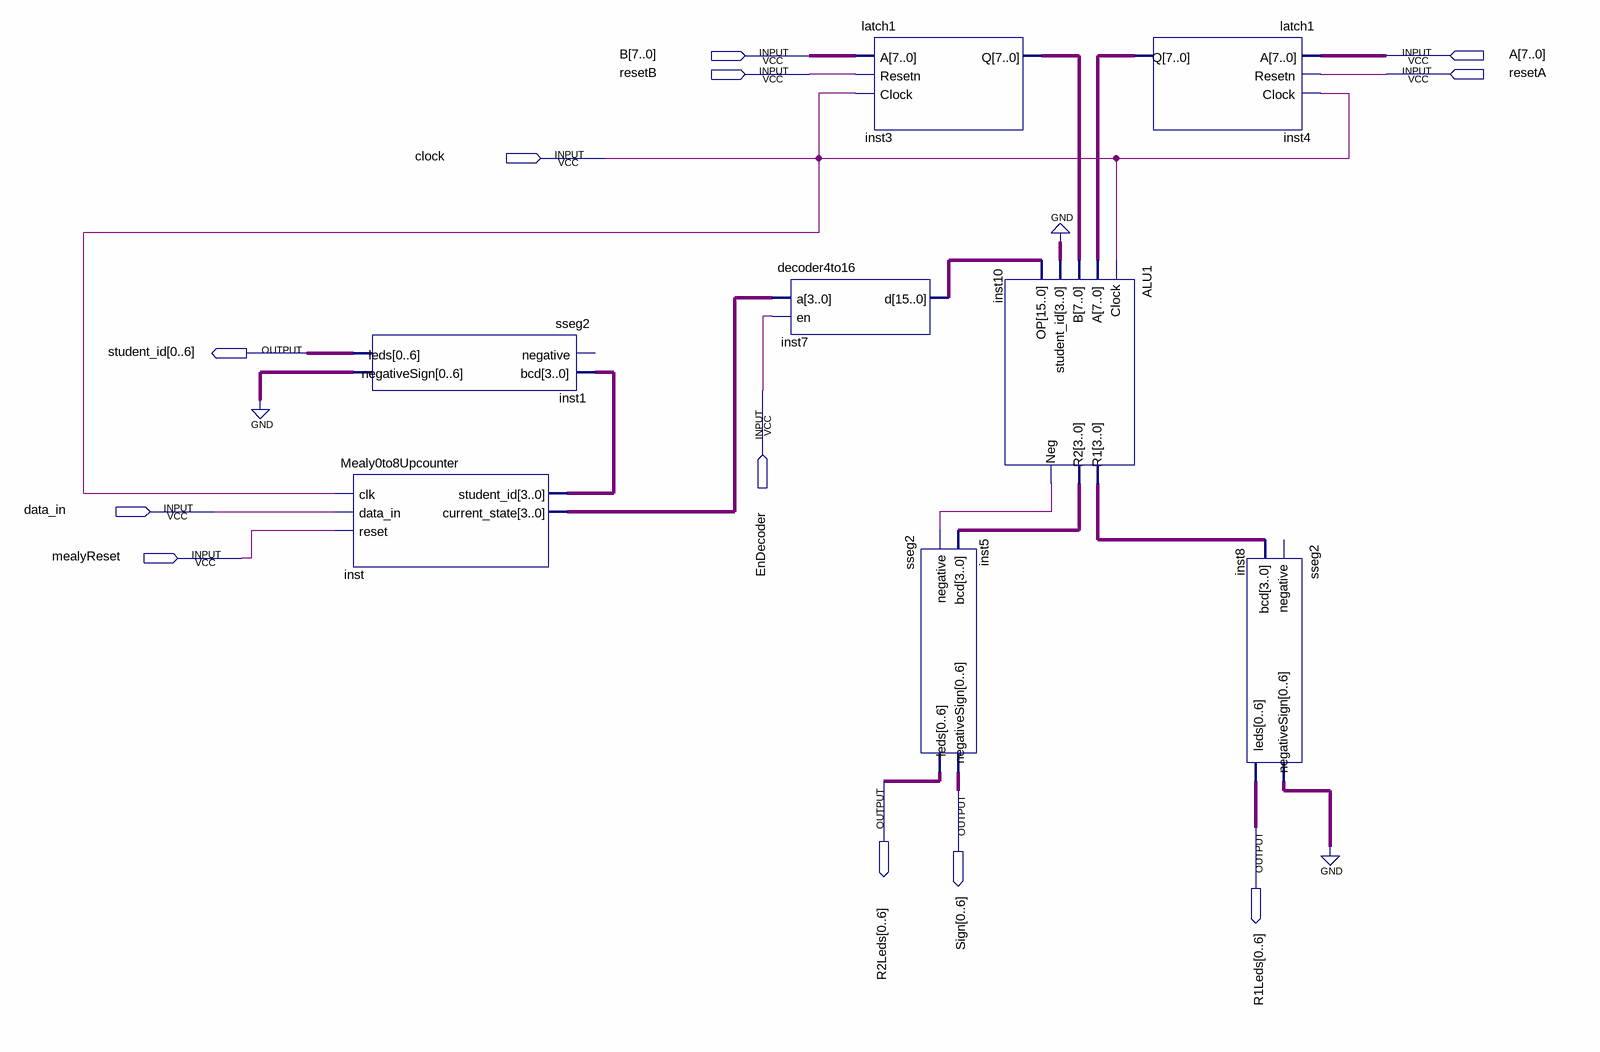
[diagram p0: schematic sheet]
// Quartus schematic Gpu.bdf as structural Verilog: 8 symbols, 12 pins
module Gpu (
  input  [7:0] B,
  input  [7:0] A,
  input  resetB,
  input  resetA,
  input  clock,
  input  EnDecoder,
  input  data_in,
  input  mealyReset,
  output [0:6] student_id,
  output [0:6] R2Leds,
  output [0:6] Sign,
  output [0:6] R1Leds
);

  wire inst10_neg;
  wire [3:0] inst10_r1, inst10_r2, inst_current_state, inst_student_id;
  wire [6:0] inst1_negativesign, inst8_negativesign;
  wire [7:0] inst3_q, inst4_q;
  wire [15:0] inst7_d;

  sseg2 inst1 (.bcd(inst_student_id), .leds(student_id), .negativeSign(inst1_negativesign));  // open: negative
  Mealy0to8Upcounter inst (
    .clk(clock), .data_in(data_in), .reset(mealyReset), .student_id(inst_student_id),
    .current_state(inst_current_state));
  decoder4to16 inst7 (.a(inst_current_state), .en(EnDecoder), .d(inst7_d));
  latch1 inst3 (.A(B), .Resetn(resetB), .Clock(clock), .Q(inst3_q));
  sseg2 inst5 (.negative(inst10_neg), .bcd(inst10_r2), .leds(R2Leds), .negativeSign(Sign));
  ALU1 inst10 (
    .Clock(clock), .A(inst4_q), .B(inst3_q), .student_id(4'b0000), .OP(inst7_d), .Neg(inst10_neg),
    .R1(inst10_r1), .R2(inst10_r2));
  latch1 inst4 (.A(A), .Resetn(resetA), .Clock(clock), .Q(inst4_q));
  sseg2 inst8 (.bcd(inst10_r1), .leds(R1Leds), .negativeSign(inst8_negativesign));  // open: negative
  // also tied to GND on the sheet: {inst1_negativesign[0], inst1_negativesign[1], inst1_negativesign[2], inst1_negativesign[3], inst1_negativesign[4], inst1_negativesign[5], inst1_negativesign[6], inst8_negativesign[0], inst8_negativesign[1], inst8_negativesign[2], inst8_negativesign[3], inst8_negativesign[4], inst8_negativesign[5], inst8_negativesign[6]}
endmodule
